# EAGLE design AUTOMATIC_LIGHTS_V2 (EAGLE 9.1.3)
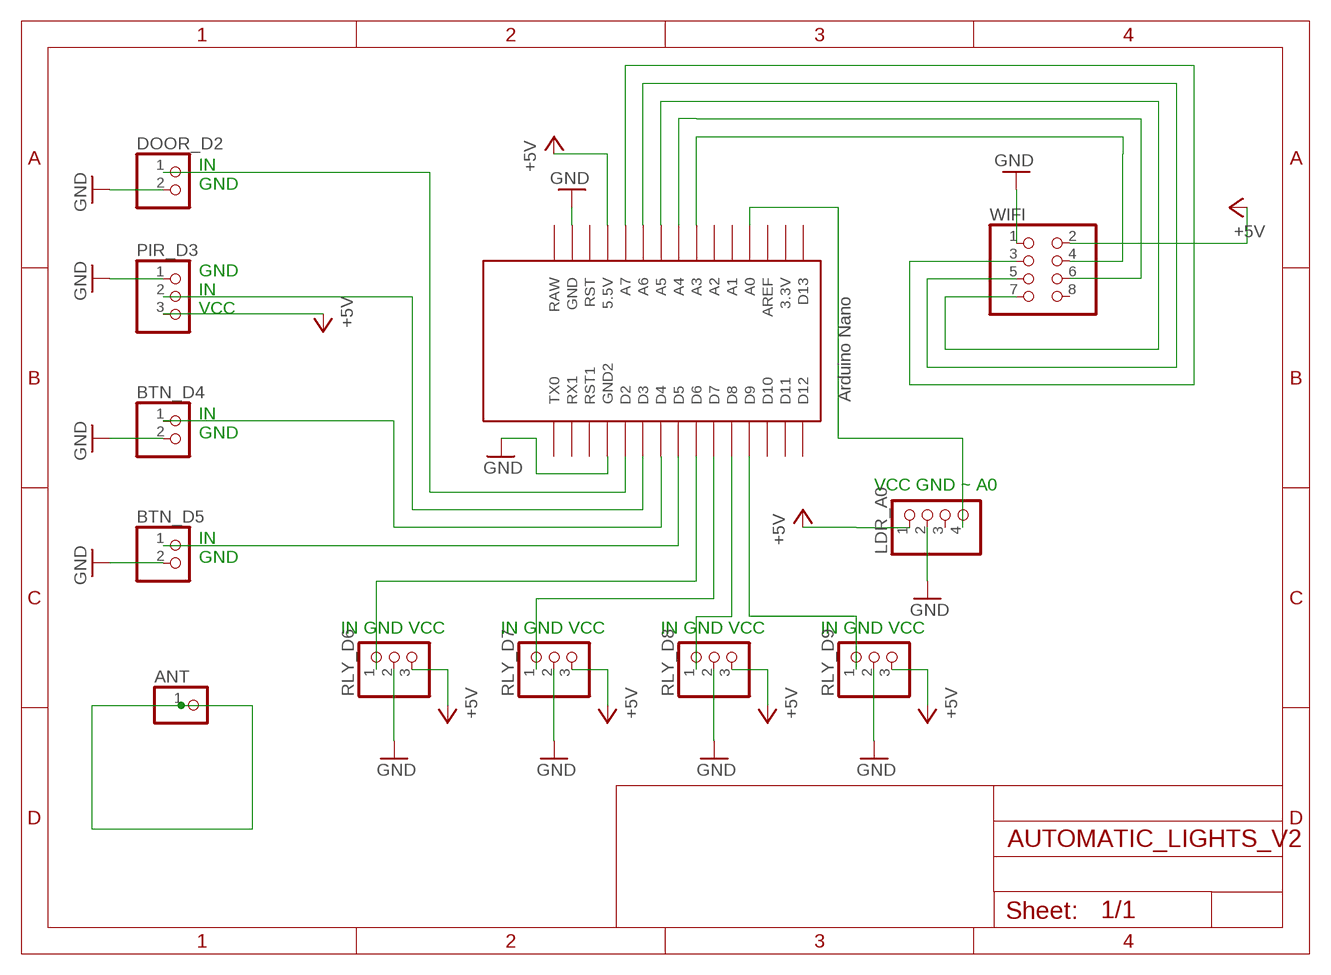
[diagram p0: schematic, sheet 1]

## Parts
ANT  PINHD-1X1  [1X01]
BTN_D4  PINHD-1X2  [1X02]
BTN_D5  PINHD-1X2  [1X02]
DOOR_D2  PINHD-1X2  [1X02]
LDR_A0  PINHD-1X4  [1X04]
PIR_D3  PINHD-1X3  [1X03]
RLY_D6  PINHD-1X3  [1X03]
RLY_D7  PINHD-1X3  [1X03]
RLY_D8  PINHD-1X3  [1X03]
RLY_D9  PINHD-1X3  [1X03]
U$1  NANO  [NANO]
WIFI  PINHD-2X4  [2X04]

## Nets
+5V: LDR_A0.1 PIR_D3.3 RLY_D6.3 RLY_D7.3 RLY_D8.3 RLY_D9.3 U$1.5V(5.5V) WIFI.2
GND: BTN_D4.2 BTN_D5.2 DOOR_D2.2 LDR_A0.2 PIR_D3.1 RLY_D6.2 RLY_D7.2 RLY_D8.2 RLY_D9.2 U$1.GND U$1.GND1(GND2) WIFI.1
N$1: LDR_A0.4 U$1.A0
N$2: ANT.1
N$3: BTN_D4.1 U$1.D4
N$4: BTN_D5.1 U$1.D5
N$6: DOOR_D2.1 U$1.D2
N$7: PIR_D3.2 U$1.D3
N$10: RLY_D6.1 U$1.D6
N$11: RLY_D7.1 U$1.D7
N$12: RLY_D8.1 U$1.D8
N$13: RLY_D9.1 U$1.D9
N$15: U$1.A7 WIFI.3
N$16: U$1.A6 WIFI.5
N$17: U$1.A5 WIFI.7
N$18: U$1.A3 WIFI.4
N$19: U$1.A4 WIFI.6
Unconnected: LDR_A0.3 U$1.3.3V U$1.A1 U$1.A2 U$1.AREF U$1.D10 U$1.D11 U$1.D12 U$1.D13 U$1.ICSP1 U$1.ICSP2 U$1.ICSP3 U$1.ICSP4 U$1.ICSP5 U$1.ICSP6 U$1.RAW U$1.RST U$1.RST1 U$1.RX1 U$1.TX0 WIFI.8

## Notes on the sheet
- IN
  GND
- GND
  IN
  VCC
- IN
  GND
- VCC GND ~ A0
- IN
  GND
- IN GND VCC | IN GND VCC | IN GND VCC | IN GND VCC

## Library data of the parts
ANT = pinhead:PINHD-1X1: PIN HEADER
BTN_D4 BTN_D5 DOOR_D2 = pinhead:PINHD-1X2: PIN HEADER
LDR_A0 = pinhead:PINHD-1X4: PIN HEADER
PIR_D3 RLY_D6-RLY_D9 = pinhead:PINHD-1X3: PIN HEADER
U$1 = Arduino-clone:NANO: Arduino Nano
WIFI = pinhead:PINHD-2X4: PIN HEADER

## Board
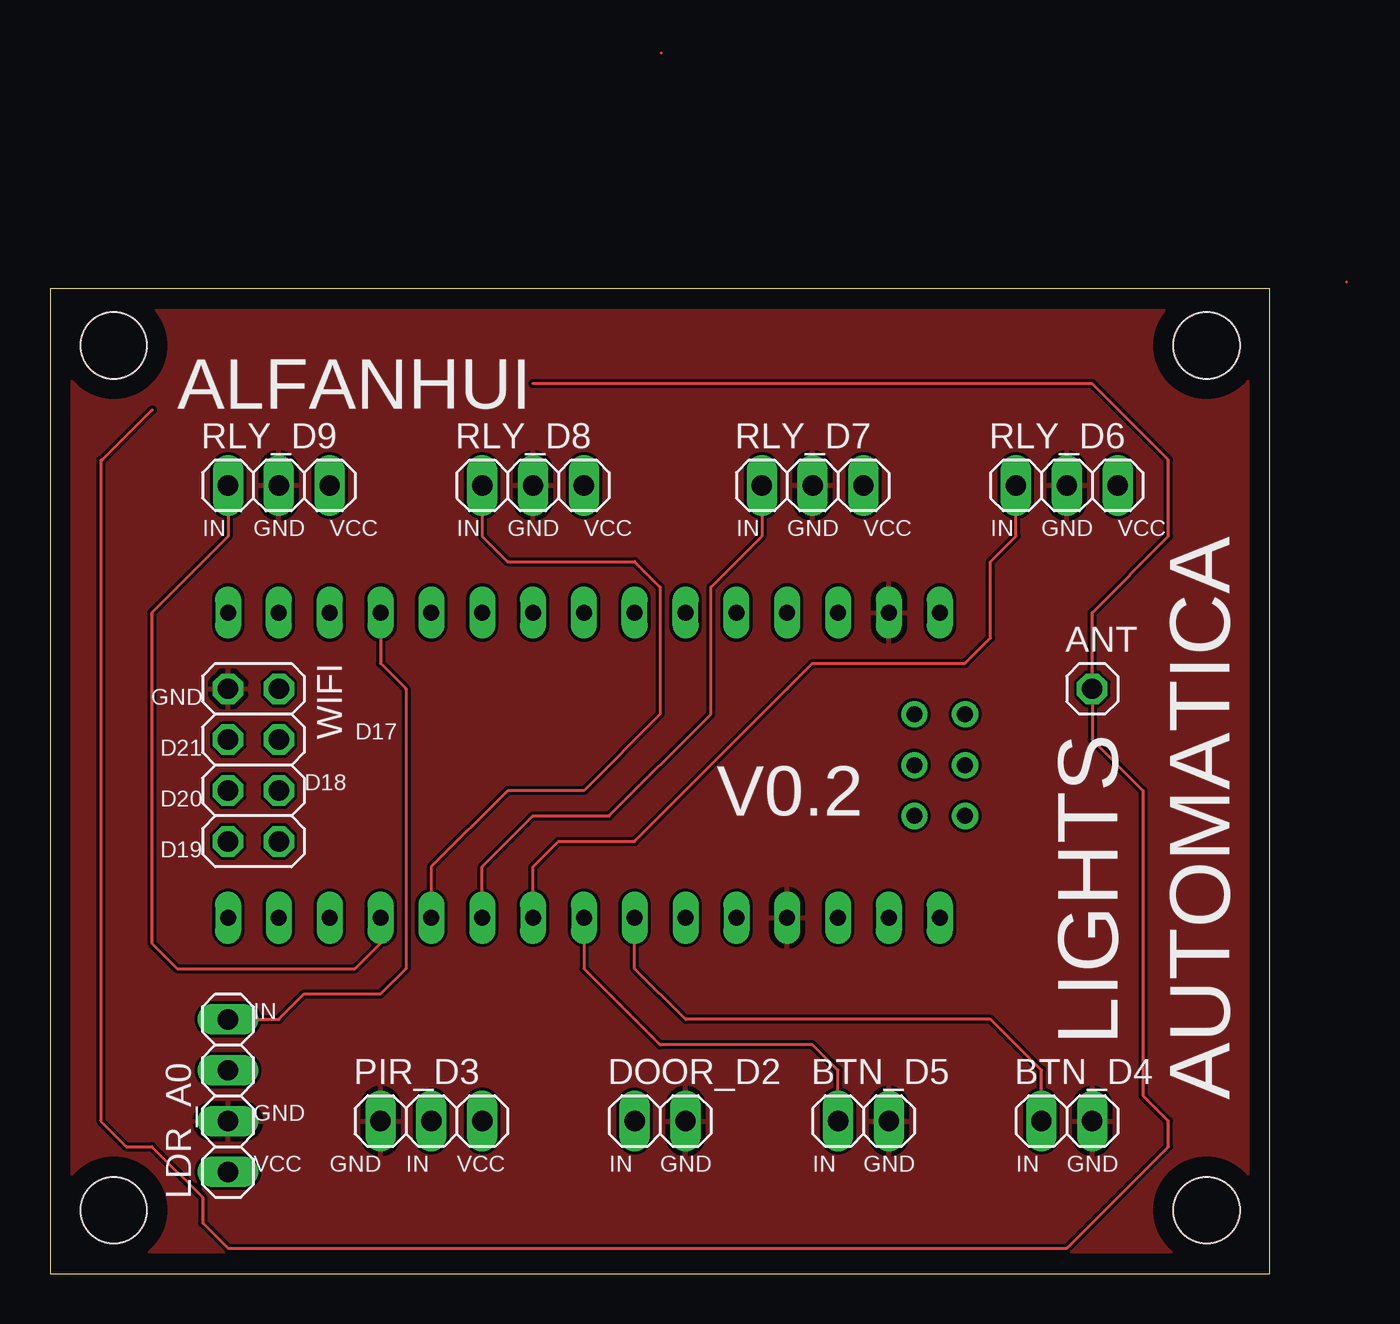
[diagram p1: board, top side]
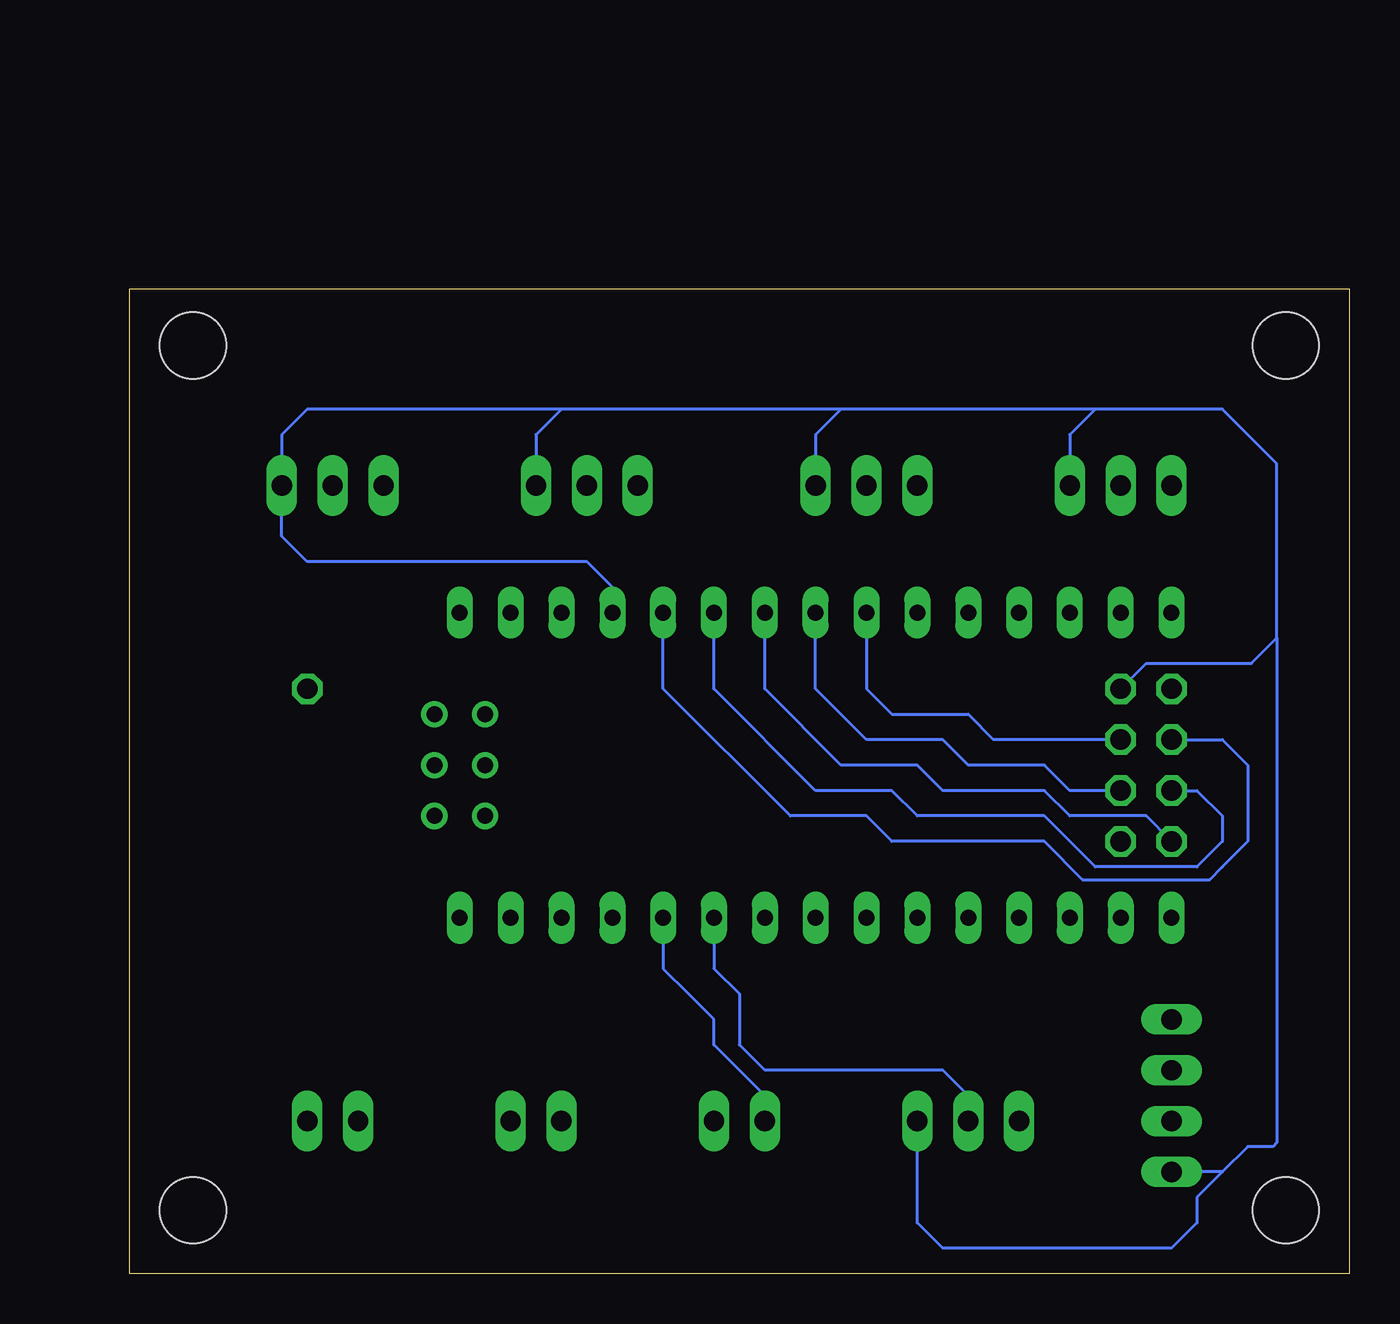
[diagram p2: board, bottom side, seen from below]

Size 60.94 x 49.2 mm. Coordinates in mm from the lower left corner, seen from the top.
Outline: 0,0 60.94,0 60.94,49.2 0,49.2 0,0
Copper layers (1*16): Top 0.035mm / dielectric 1.5mm / Bottom 0.035mm
Design rules "default": minimum track width 6mil, minimum drill 0.35mm, track to track 6mil, track to pad 6mil, pad to pad 6mil, via to via 6mil, smd to smd 6mil, copper to edge 40mil, drill to drill 6mil, minimum pad ring 10mil, minimum via ring 8mil, stop-mask expansion 4mil, vias tented up to drill 0mil, thermal gap 10mil
Holes 3.3 mm at 3.17,46.35 3.17,3.17 57.78,3.17 57.78,46.35

### Footprints (pad centres in the part's own frame; a part is rotated, then mirrored left to right if it is on the bottom)
1X01 = drill 1.016 octagon: 1 0,0
1X02 = drill 1.016 long: 1 -1.27,0; 2 1.27,0
1X04 = drill 1.016 long: 1 -3.81,0; 2 -1.27,0; 3 1.27,0; 4 3.81,0
1X03 = drill 1.016 long: 1 -2.54,0; 2 0,0; 3 2.54,0
NANO = drill 0.8 long: 3.3V -10.16,24.13; 5V -10.16,-1.27; A0 -10.16,19.05; A1 -10.16,16.51; A2 -10.16,13.97; A3 -10.16,11.43; A4 -10.16,8.89; A5 -10.16,6.35; A6 -10.16,3.81; A7 -10.16,1.27; AREF -10.16,21.59; D2 5.08,1.27; D3 5.08,3.81; D4 5.08,6.35; D5 5.08,8.89; D6 5.08,11.43; D7 5.08,13.97; D8 5.08,16.51; D9 5.08,19.05; D10 5.08,21.59; D11 5.08,24.13; D12 5.08,26.67; D13 -10.16,26.67; GND -10.16,-6.35; GND1 5.08,-1.27; RAW -10.16,-8.89; RST -10.16,-3.81; RST1 5.08,-3.81; RX1 5.08,-6.35; TX0 5.08,-8.89 | drill 0.8: ICSP1 -5.08,-10.16; ICSP2 -5.08,-7.62; ICSP3 -2.54,-10.16; ICSP4 -2.54,-7.62; ICSP5 0,-10.16; ICSP6 0,-7.62
2X04 = drill 1.016 octagon: 1 -3.81,-1.27; 2 -3.81,1.27; 3 -1.27,-1.27; 4 -1.27,1.27; 5 1.27,-1.27; 6 1.27,1.27; 7 3.81,-1.27; 8 3.81,1.27

### Placement (x,y rotation side)
ANT  52.07,29.21 0 top
BTN_D4  50.8,7.62 0 top
BTN_D5  40.64,7.62 0 top
DOOR_D2  30.48,7.62 0 top
LDR_A0  8.89,8.89 90 top
PIR_D3  19.05,7.62 0 top
RLY_D6  50.8,39.37 0 top
RLY_D7  38.1,39.37 0 top
RLY_D8  24.13,39.37 0 top
RLY_D9  11.43,39.37 0 top
U$1  35.56,22.86 270 bottom
WIFI  10.16,25.4 270 top

### Tracks (layer width: path | path; a pad name or v marks a point on that pad's centre or on a via)
+5V
  Bottom 0.152: 3.63,31.75 3.63,40.46 6.35,43.18 12.7,43.18 | 12.7,43.18 13.97,41.91 RLY_D9.3 | 12.7,43.18 25.4,43.18 | 25.4,43.18 26.67,41.91 RLY_D8.3 | 25.4,43.18 39.37,43.18 | 39.37,43.18 40.64,41.91 RLY_D7.3 | 39.37,43.18 43.18,43.18 52.07,43.18 53.34,41.91 RLY_D6.3 53.34,36.83 52.07,35.56 38.1,35.56 36.83,34.29 U$1.5V | 6.35,5.08 LDR_A0.1 | PIR_D3.3 21.59,2.54 20.32,1.27 8.89,1.27 7.62,2.54 7.62,3.81 6.35,5.08 | 3.63,31.75 3.63,6.53 3.81,6.35 5.08,6.35 6.35,5.08 | WIFI.2 10.16,30.48 4.9,30.48 3.63,31.75
GND
  pour Top: 0,0 0,49.53 60.96,49.53 60.96,0
N$1
  Top 0.152: U$1.A0 16.51,30.48 17.78,29.21 17.78,15.24 16.51,13.97 12.7,13.97 11.43,12.7 LDR_A0.4
N$2
  Top 0.152: 24.13,44.45 52.07,44.45 55.88,40.64 55.88,36.83 52.07,33.02 ANT.1 52.07,26.67 54.61,24.13 54.61,8.89 55.88,7.62 55.88,6.35 50.8,1.27 8.89,1.27 7.62,2.54 7.62,3.81 5.08,6.35 3.81,6.35 2.54,7.62 2.54,40.64 2.61,40.64 5.12,43.15 | 30.55,60.96
N$3
  Top 0.152: U$1.D4 29.21,15.24 31.75,12.7 46.99,12.7 49.53,10.16 BTN_D4.1
N$4
  Top 0.152: U$1.D5 26.67,15.24 30.48,11.43 38.1,11.43 39.37,10.16 BTN_D5.1 39.37,8.89
N$6
  Bottom 0.152: U$1.D2 34.29,15.24 33.02,13.97 31.75,12.7 31.75,11.43 29.21,8.89 DOOR_D2.1
N$7
  Bottom 0.152: U$1.D3 31.75,15.24 30.48,13.97 30.48,11.43 29.21,10.16 20.32,10.16 19.05,8.89 PIR_D3.2
N$10
  Top 0.152: U$1.D6 24.13,20.32 25.4,21.59 29.21,21.59 36.83,29.21 38.1,30.48 45.72,30.48 46.99,31.75 46.99,35.56 48.26,36.83 RLY_D6.1 | 64.77,49.53
N$11
  Top 0.152: RLY_D7.1 35.56,36.83 33.02,34.29 33.02,27.94 27.94,22.86 24.13,22.86 21.59,20.32 U$1.D7
N$12
  Top 0.152: U$1.D8 19.05,20.32 22.86,24.13 26.67,24.13 30.48,27.94 30.48,34.29 29.21,35.56 22.86,35.56 21.59,36.83 RLY_D8.1
N$13
  Top 0.152: U$1.D9 16.51,16.51 15.24,15.24 6.35,15.24 5.08,16.51 5.08,33.02 8.89,36.83 RLY_D9.1
N$15
  Bottom 0.152: U$1.A7 34.29,29.21 27.94,22.86 24.13,22.86 22.86,21.59 15.24,21.59 13.34,19.68 6.99,19.68 6.35,20.32 5.08,21.59 5.08,25.4 6.35,26.67 WIFI.3
N$16
  Bottom 0.152: U$1.A6 31.75,29.21 26.67,24.13 22.86,24.13 21.59,22.86 15.24,22.86 12.7,20.32 7.62,20.32 6.35,21.59 6.35,22.86 7.62,24.13 WIFI.5
N$17
  Bottom 0.152: WIFI.7 10.16,22.86 13.97,22.86 15.24,24.13 20.32,24.13 21.59,25.4 25.4,25.4 29.21,29.21 U$1.A5 29.21,31.75
N$18
  Bottom 0.152: WIFI.4 17.78,26.67 19.05,27.94 22.86,27.94 24.13,29.21 U$1.A3
N$19
  Bottom 0.152: U$1.A4 26.67,29.21 24.13,26.67 20.32,26.67 19.05,25.4 15.24,25.4 13.97,24.13 WIFI.6

### Text on the board
tNames: ALFANHUI | IN | GND | VCC | IN | GND | VCC | IN | GND | VCC | IN | GND | VCC | AUTOMATICA | GND | D21 | D17 | V0.2 | D20 | D18 | D19 | IN | LIGHTS | GND | VCC | GND | IN | VCC | IN | GND | IN | GND | IN | GND